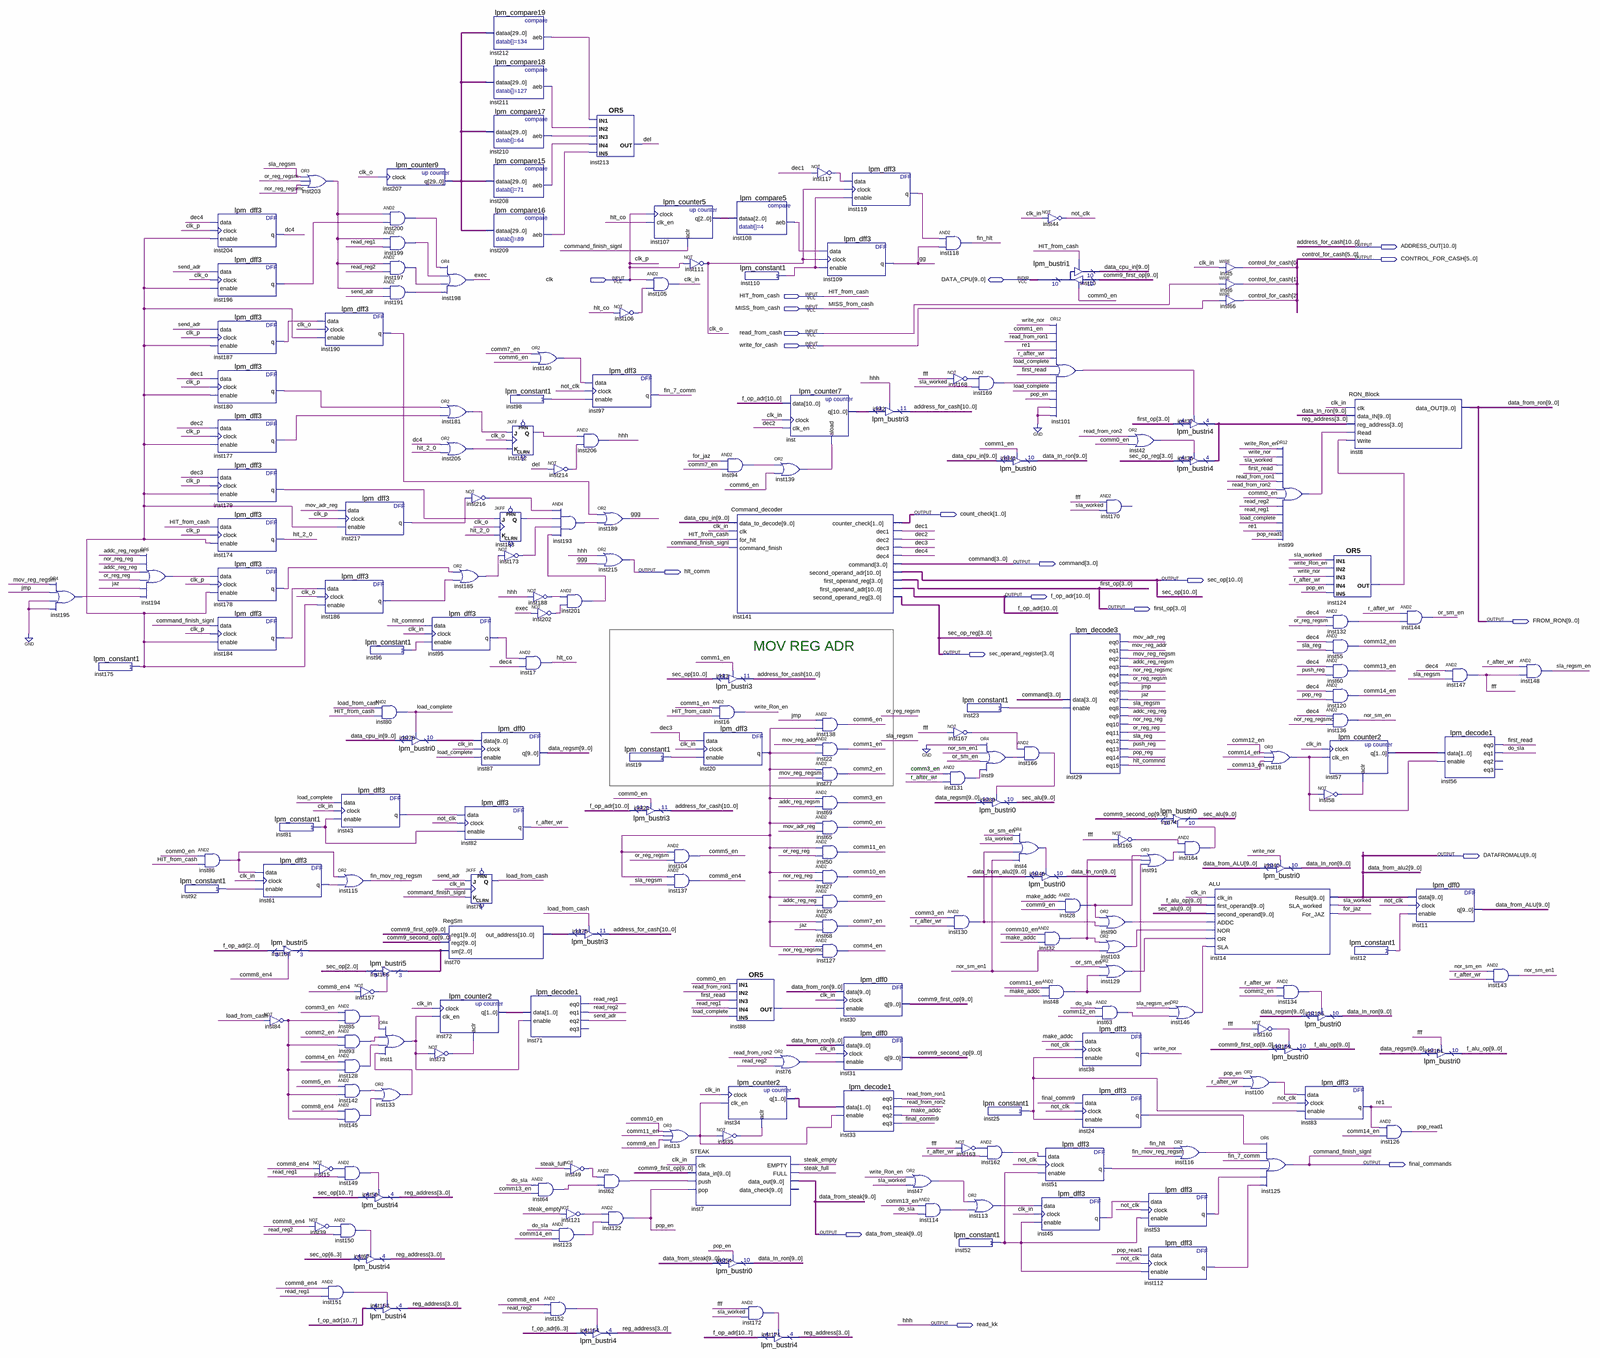
[diagram p0: schematic sheet, whole]
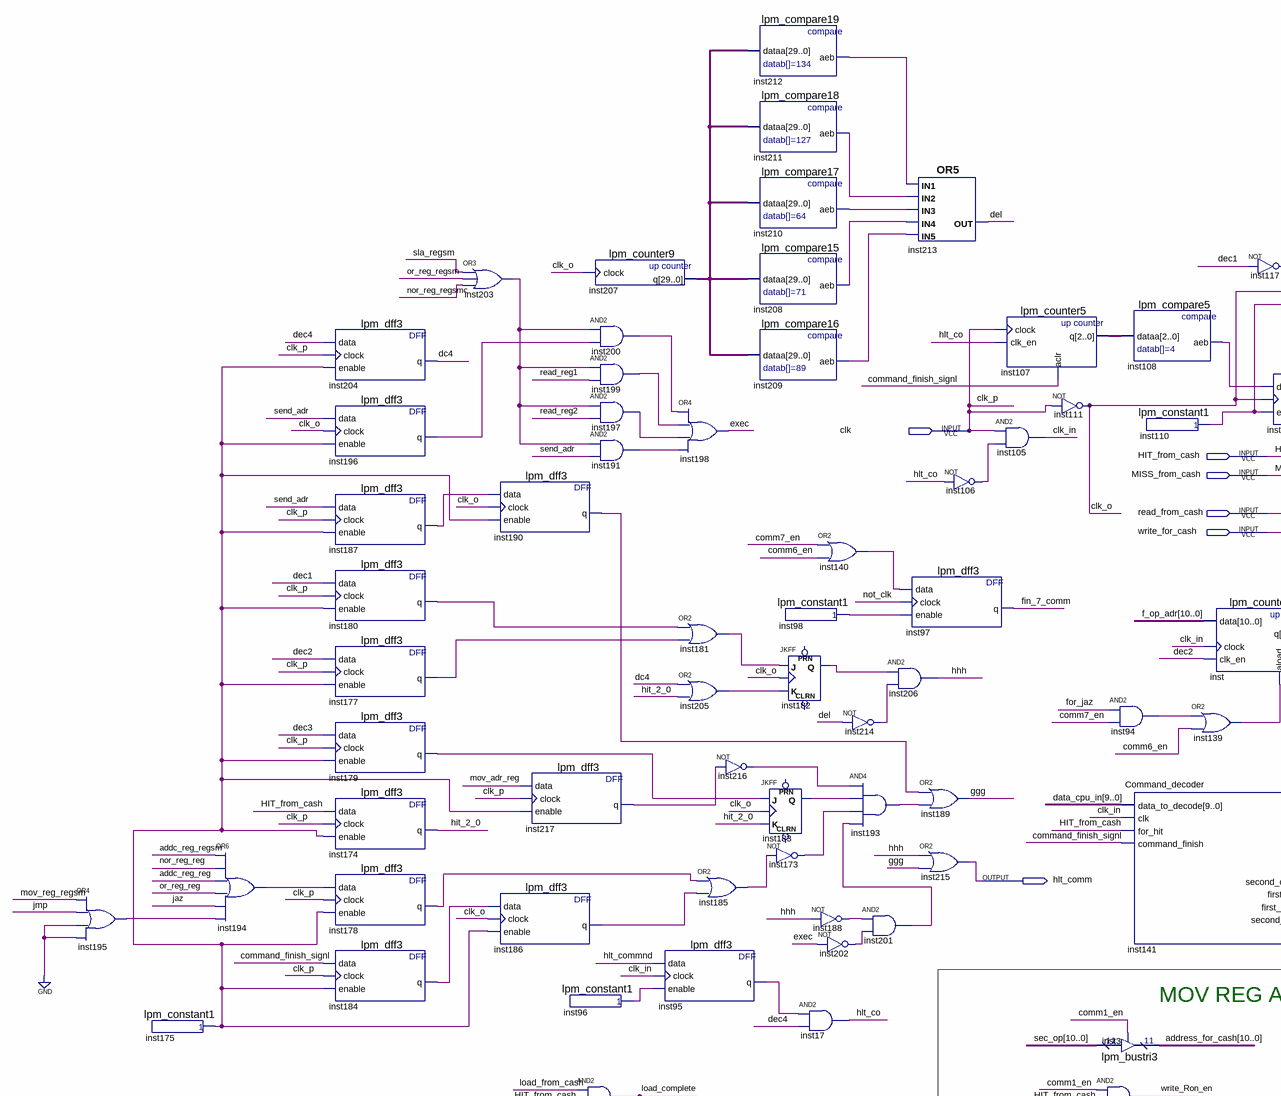
[diagram p1: schematic sheet, upper left part]
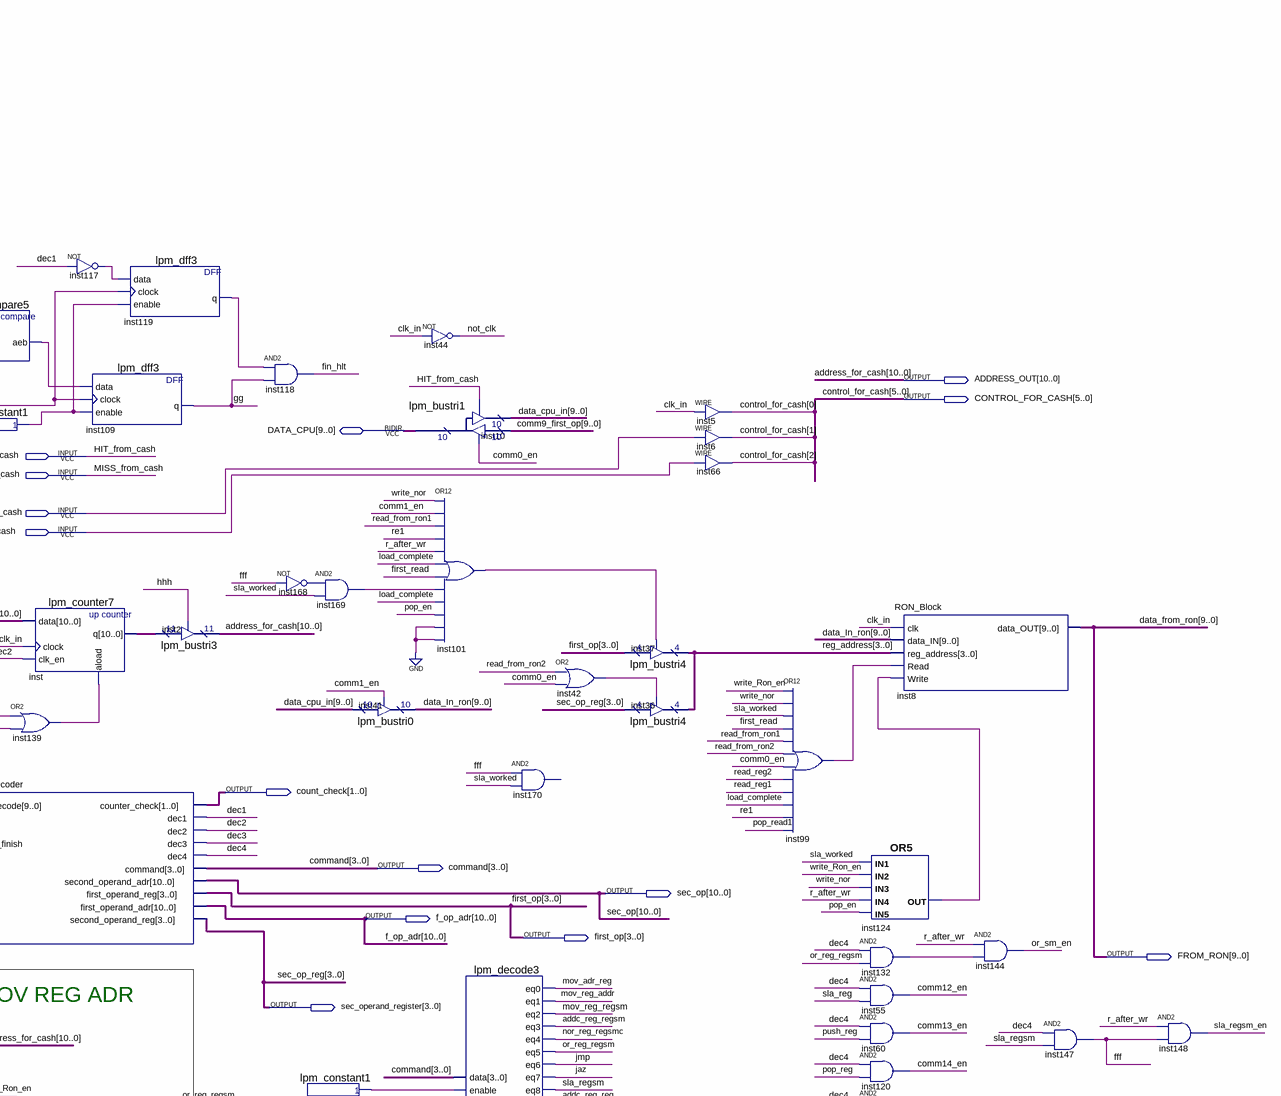
[diagram p2: schematic sheet, upper right part]
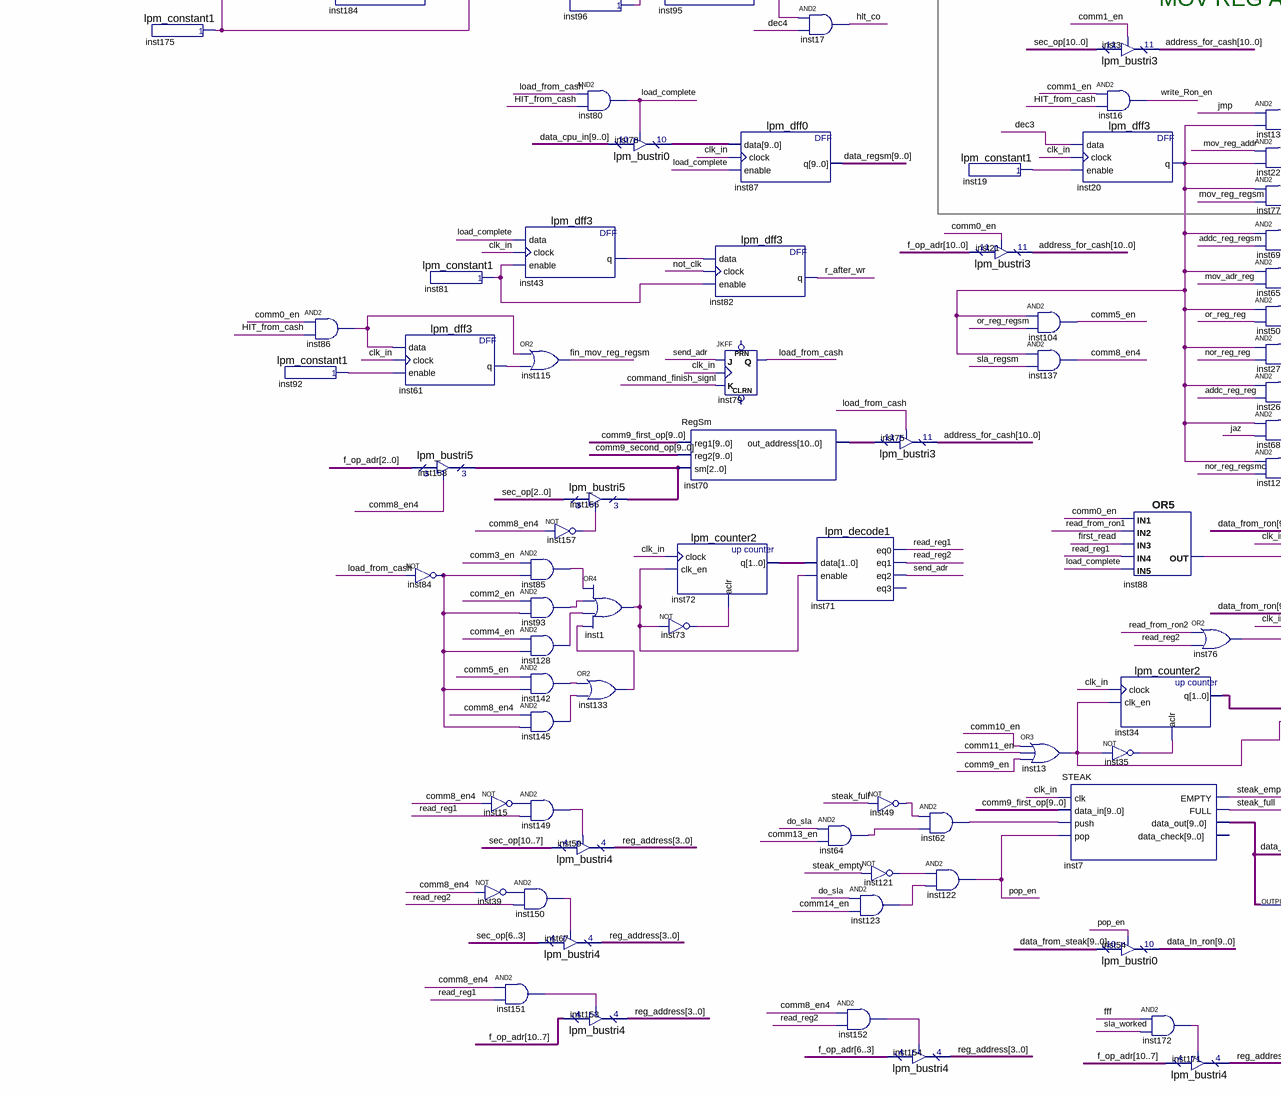
[diagram p3: schematic sheet, lower left part]
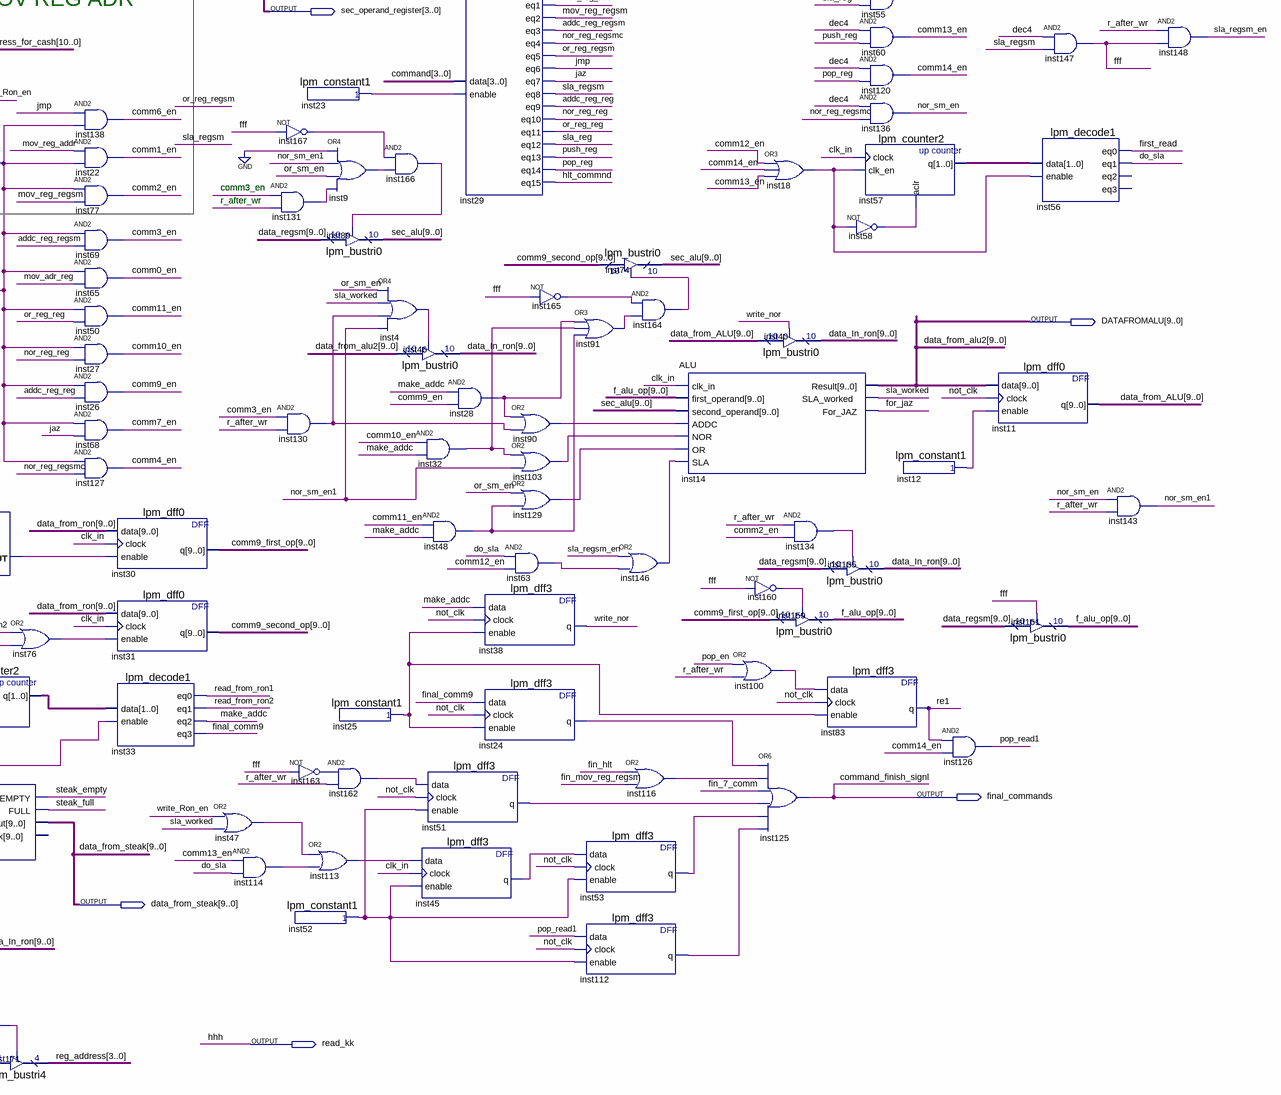
[diagram p4: schematic sheet, lower right part]
// Quartus schematic CPU.bdf as structural Verilog: 214 symbols, 20 pins
module CPU (
  input  clk,
  input  HIT_from_cash,
  input  MISS_from_cash,
  input  read_from_cash,
  input  write_for_cash,
  inout  [9:0] DATA_CPU,
  output [10:0] ADDRESS_OUT,
  output [5:0] CONTROL_FOR_CASH,
  output [1:0] count_check,
  output [3:0] command,
  output hlt_comm,
  output [10:0] sec_op,
  output [10:0] f_op_adr,
  output [3:0] first_op,
  output [9:0] FROM_RON,
  output [3:0] sec_operand_register,
  output [9:0] DATAFROMALU,
  output final_commands,
  output [9:0] data_from_steak,
  output read_kk
);

  wire addc_reg_reg, addc_reg_regsm, clk_in, clk_o, comm0_en, comm1_en, comm2_en, comm3_en, comm4_en,
       comm5_en, comm6_en, comm7_en, comm8_en4, comm9_en, comm10_en, comm11_en, comm12_en, comm13_en,
       comm14_en, dc4, dec1, dec2, dec3, dec4, del, do_sla, exec, fff, fin_7_comm, fin_hlt,
       fin_mov_reg_regsm, final_comm9, first_read, for_jaz, gg, ggg, hit_2_0, hlt_co, hlt_commnd, inst1_out,
       inst4_out, inst9_out, inst12_result, inst13_out, inst15_out, inst18_out, inst19_result, inst20_q,
       inst23_result, inst24_q, inst25_result, inst28_out, inst32_out, inst35_out, inst39_out, inst42_out,
       inst43_q, inst45_q, inst47_out, inst48_out, inst49_out, inst51_q, inst52_result, inst53_q, inst58_out,
       inst61_q, inst62_out, inst63_out, inst64_out, inst73_out, inst76_out, inst81_result, inst84_out,
       inst85_out, inst86_out, inst88_out, inst90_out, inst91_out, inst92_result, inst93_out, inst94_out,
       inst95_q, inst96_result, inst98_result, inst99_out, inst100_out, inst101_out, inst103_out,
       inst106_out, inst108_aeb, inst110_result, inst112_q, inst113_out, inst114_out, inst116_out,
       inst117_out, inst119_q, inst121_out, inst123_out, inst124_out, inst128_out, inst129_out, inst130_out,
       inst131_out, inst132_out, inst133_out, inst134_out, inst139_out, inst140_out, inst142_out,
       inst145_out, inst146_out, inst149_out, inst150_out, inst151_out, inst152_out, inst157_out,
       inst160_out, inst162_out, inst163_out, inst164_out, inst165_out, inst166_out, inst167_out,
       inst168_out, inst169_out, inst172_out, inst173_out, inst175_result, inst177_q, inst178_q, inst179_q,
       inst180_q, inst181_out, inst182_q, inst183_q, inst184_q, inst185_out, inst186_q, inst187_q,
       inst188_out, inst190_q, inst191_out, inst193_out, inst194_out, inst195_out, inst196_q, inst197_out,
       inst199_out, inst200_out, inst201_out, inst202_out, inst203_out, inst205_out, inst208_aeb,
       inst209_aeb, inst210_aeb, inst211_aeb, inst212_aeb, inst214_out, inst216_out, inst217_q, jaz, jmp,
       load_complete, load_from_cash, make_addc, mov_adr_reg, mov_reg_addr, mov_reg_regsm, nor_reg_reg,
       nor_reg_regsmc, nor_sm_en, nor_sm_en1, not_clk, or_reg_reg, or_reg_regsm, or_sm_en, pop_en, pop_read1,
       pop_reg, push_reg, r_after_wr, re1, read_from_ron1, read_from_ron2, read_reg1, read_reg2, send_adr,
       sla_reg, sla_regsm, sla_regsm_en, sla_worked, steak_empty, steak_full, write_nor, write_Ron_en;
  wire [1:0] inst34_q, inst57_q, inst72_q;
  wire [2:0] inst107_q, inst158_tridata;
  wire [3:0] reg_address;
  wire [9:0] comm9_first_op, comm9_second_op, data_cpu_in, data_from_ALU, data_In_ron, data_regsm, f_alu_op,
       inst78_tridata, sec_alu;
  wire [10:0] inst70_out_address, inst_q;
  wire [29:0] inst207_q;

  or inst195 (inst195_out, mov_reg_regsm, jmp, 1'b0, 1'b0);
  lpm_constant1 inst175 (.result(inst175_result));
  or inst194 (inst194_out, addc_reg_regsm, nor_reg_reg, addc_reg_reg, or_reg_reg, jaz, inst195_out);
  lpm_constant1 inst92 (.result(inst92_result));
  lpm_dff3 inst204 (.data(dec4), .clock(clk), .enable(inst175_result), .q(dc4));
  lpm_dff3 inst196 (.data(send_adr), .clock(clk_o), .enable(inst175_result), .q(inst196_q));
  lpm_dff3 inst187 (.data(send_adr), .clock(clk), .enable(inst175_result), .q(inst187_q));
  lpm_dff3 inst180 (.data(dec1), .clock(clk), .enable(inst175_result), .q(inst180_q));
  lpm_dff3 inst177 (.data(dec2), .clock(clk), .enable(inst175_result), .q(inst177_q));
  lpm_dff3 inst179 (.data(dec3), .clock(clk), .enable(inst175_result), .q(inst179_q));
  lpm_dff3 inst174 (.data(HIT_from_cash), .clock(clk), .enable(inst175_result), .q(hit_2_0));
  lpm_dff3 inst178 (.data(inst194_out), .clock(clk), .enable(inst175_result), .q(inst178_q));
  lpm_dff3 inst184 (.data(final_commands), .clock(clk), .enable(inst175_result), .q(inst184_q));
  and inst86 (inst86_out, comm0_en, HIT_from_cash);
  lpm_constant1 inst81 (.result(inst81_result));
  lpm_dff3 inst61 (.data(inst86_out), .clock(clk_in), .enable(inst92_result), .q(inst61_q));
  lpm_bustri5 inst158 (.enabledt(comm8_en4), .data(f_op_adr[2:0]), .tridata(inst158_tridata));
  not inst84 (inst84_out, load_from_cash);
  or inst203 (inst203_out, sla_regsm, or_reg_regsm, nor_reg_regsmc);
  not inst39 (inst39_out, comm8_en4);
  lpm_dff3 inst190 (.data(inst187_q), .clock(clk_o), .enable(inst175_result), .q(inst190_q));
  lpm_dff3 inst217 (.data(mov_adr_reg), .clock(clk), .enable(inst175_result), .q(inst217_q));
  lpm_dff3 inst186 (.data(inst184_q), .clock(clk_o), .enable(inst175_result), .q(inst186_q));
  lpm_dff3 inst43 (.data(load_complete), .clock(clk_in), .enable(inst81_result), .q(inst43_q));
  or inst115 (fin_mov_reg_regsm, inst86_out, inst61_q);
  and inst85 (inst85_out, comm3_en, inst84_out);
  and inst93 (inst93_out, comm2_en, inst84_out);
  and inst128 (inst128_out, comm4_en, inst84_out);
  and inst142 (inst142_out, comm5_en, inst84_out);
  and inst145 (inst145_out, comm8_en4, inst84_out);
  and inst149 (inst149_out, inst15_out, read_reg1);
  not inst15 (inst15_out, comm8_en4);
  and inst150 (inst150_out, inst39_out, read_reg2);
  and inst151 (inst151_out, comm8_en4, read_reg1);
  lpm_constant1 inst96 (.result(inst96_result));
  and inst80 (load_complete, load_from_cash, HIT_from_cash);
  lpm_bustri5 inst156 (.enabledt(inst157_out), .data(sec_op[2:0]), .tridata(inst158_tridata));
  not inst157 (inst157_out, comm8_en4);
  or inst133 (inst133_out, inst142_out, inst145_out);
  lpm_bustri4 inst59 (.enabledt(inst149_out), .data(sec_op[10:7]), .tridata(reg_address));
  lpm_bustri4 inst67 (.enabledt(inst150_out), .data(sec_op[6:3]), .tridata(reg_address));
  lpm_bustri4 inst153 (.enabledt(inst151_out), .data(f_op_adr[10:7]), .tridata(reg_address));
  lpm_counter9 inst207 (.clock(clk_o), .q(inst207_q));
  and inst200 (inst200_out, inst203_out, inst196_q);
  and inst199 (inst199_out, inst203_out, read_reg1);
  and inst197 (inst197_out, inst203_out, read_reg2);
  and inst191 (inst191_out, inst203_out, send_adr);
  lpm_bustri0 inst78 (.enabledt(load_complete), .data(data_cpu_in), .tridata(inst78_tridata));
  or inst1 (inst1_out, inst85_out, inst93_out, inst128_out, inst133_out);
  or inst198 (exec, inst200_out, inst199_out, inst197_out, inst191_out);
  or inst181 (inst181_out, inst180_q, inst177_q);
  or inst205 (inst205_out, dc4, hit_2_0);
  lpm_dff3 inst95 (.data(hlt_commnd), .clock(clk_in), .enable(inst96_result), .q(inst95_q));
  RegSm inst70 (.reg1(comm9_first_op), .reg2(comm9_second_op), .sm(inst158_tridata), .out_address(inst70_out_address));
  lpm_counter2 inst72 (.clock(clk_in), .clk_en(inst1_out), .aclr(inst73_out), .q(inst72_q));
  not inst73 (inst73_out, inst1_out);
  not inst216 (inst216_out, inst217_q);
  or inst185 (inst185_out, inst178_q, inst186_q);
  lpm_dff0 inst87 (.data(inst78_tridata), .clock(clk_in), .enable(load_complete), .q(data_regsm));
  lpm_dff3 inst82 (.data(inst43_q), .clock(not_clk), .enable(inst81_result), .q(r_after_wr));
  JKFF inst79 (.K(final_commands), .J(send_adr), .CLK(clk_in), .Q(load_from_cash));  // open: PRN, CLRN
  lpm_compare19 inst212 (.dataa(inst207_q), .aeb(inst212_aeb));
  lpm_compare18 inst211 (.dataa(inst207_q), .aeb(inst211_aeb));
  lpm_compare17 inst210 (.dataa(inst207_q), .aeb(inst210_aeb));
  lpm_compare15 inst208 (.dataa(inst207_q), .aeb(inst208_aeb));
  lpm_compare16 inst209 (.dataa(inst207_q), .aeb(inst209_aeb));
  lpm_constant1 inst98 (.result(inst98_result));
  JKFF inst182 (.K(inst205_out), .J(inst181_out), .CLK(clk_o), .Q(inst182_q));  // open: PRN, CLRN
  JKFF inst183 (.K(hit_2_0), .J(inst179_q), .CLK(clk_o), .Q(inst183_q));  // open: PRN, CLRN
  not inst173 (inst173_out, inst185_out);
  or inst140 (inst140_out, comm7_en, comm6_en);
  not inst188 (inst188_out, read_kk);
  not inst202 (inst202_out, exec);
  and inst17 (hlt_co, inst95_q, dec4);
  lpm_decode1 inst71 (
    .data(inst72_q), .enable(inst1_out), .eq0(read_reg1), .eq1(read_reg2), .eq2(send_adr));  // open: eq3
  and inst64 (inst64_out, do_sla, comm13_en);
  not inst214 (inst214_out, del);
  and inst193 (inst193_out, inst216_out, inst183_q, inst173_out, inst201_out);
  and inst201 (inst201_out, inst188_out, inst202_out);
  lpm_bustri3 inst75 (.enabledt(load_from_cash), .data(inst70_out_address), .tridata(ADDRESS_OUT));
  not inst49 (inst49_out, steak_full);
  not inst121 (inst121_out, steak_empty);
  and inst123 (inst123_out, do_sla, comm14_en);
  and inst152 (inst152_out, comm8_en4, read_reg2);
  or inst213 (del, inst212_aeb, inst211_aeb, inst210_aeb, inst208_aeb, inst209_aeb);
  lpm_dff3 inst97 (.data(inst140_out), .clock(not_clk), .enable(inst98_result), .q(fin_7_comm));
  and inst206 (read_kk, inst182_q, inst214_out);
  or inst189 (ggg, inst190_q, inst193_out);
  or inst215 (hlt_comm, read_kk, ggg);
  and inst62 (inst62_out, inst49_out, inst64_out);
  and inst122 (pop_en, inst121_out, inst123_out);
  lpm_bustri4 inst154 (.enabledt(inst152_out), .data(f_op_adr[6:3]), .tridata(reg_address));
  not inst106 (inst106_out, hlt_co);
  lpm_constant1 inst19 (.result(inst19_result));
  lpm_bustri3 inst21 (.enabledt(comm0_en), .data(f_op_adr), .tridata(ADDRESS_OUT));
  lpm_counter5 inst107 (.clock(clk), .clk_en(hlt_co), .aclr(final_commands), .q(inst107_q));
  and inst105 (clk_in, clk, inst106_out);
  and inst104 (comm5_en, inst20_q, or_reg_regsm);
  and inst137 (comm8_en4, inst20_q, sla_regsm);
  or inst13 (inst13_out, comm10_en, comm11_en, comm9_en);
  not inst111 (clk_o, clk);
  lpm_dff3 inst20 (.data(dec3), .clock(clk_in), .enable(inst19_result), .q(inst20_q));
  STEAK inst7 (
    .clk(clk_in), .data_in(comm9_first_op), .push(inst62_out), .pop(pop_en), .EMPTY(steak_empty),
    .FULL(steak_full), .data_out(data_from_steak));  // open: data_check
  lpm_compare5 inst108 (.dataa(inst107_q), .aeb(inst108_aeb));
  lpm_constant1 inst110 (.result(inst110_result));
  and inst94 (inst94_out, for_jaz, comm7_en);
  Command_decoder inst141 (
    .data_to_decode(data_cpu_in), .clk(clk_in), .for_hit(HIT_from_cash), .command_finish(final_commands),
    .counter_check(count_check), .dec1(dec1), .dec2(dec2), .dec3(dec3), .dec4(dec4), .command(command),
    .second_operand_adr(sec_op), .first_operand_reg(first_op), .first_operand_adr(f_op_adr),
    .second_operand_reg(sec_operand_register));
  lpm_bustri3 inst3 (.enabledt(comm1_en), .data(sec_op), .tridata(ADDRESS_OUT));
  and inst16 (write_Ron_en, comm1_en, HIT_from_cash);
  or inst88 (inst88_out, comm0_en, read_from_ron1, first_read, read_reg1, load_complete);
  lpm_counter2 inst34 (.clock(clk_in), .clk_en(inst13_out), .aclr(inst35_out), .q(inst34_q));
  not inst35 (inst35_out, inst13_out);
  lpm_bustri0 inst54 (.enabledt(pop_en), .data(data_from_steak), .tridata(data_In_ron));
  and inst172 (inst172_out, fff, sla_worked);
  lpm_bustri4 inst171 (.enabledt(inst172_out), .data(f_op_adr[10:7]), .tridata(reg_address));
  lpm_counter7 inst (.data(f_op_adr), .clock(clk_in), .clk_en(dec2), .aload(inst139_out), .q(inst_q));
  or inst139 (inst139_out, inst94_out, comm6_en);
  or inst76 (inst76_out, read_from_ron2, read_reg2);
  not inst117 (inst117_out, dec1);
  lpm_dff3 inst109 (.data(inst108_aeb), .clock(clk_o), .enable(inst110_result), .q(gg));
  and inst138 (comm6_en, jmp, inst20_q);
  and inst22 (comm1_en, mov_reg_addr, inst20_q);
  and inst77 (comm2_en, inst20_q, mov_reg_regsm);
  and inst69 (comm3_en, inst20_q, addc_reg_regsm);
  and inst65 (comm0_en, inst20_q, mov_adr_reg);
  and inst50 (comm11_en, inst20_q, or_reg_reg);
  and inst27 (comm10_en, inst20_q, nor_reg_reg);
  and inst26 (comm9_en, inst20_q, addc_reg_reg);
  and inst68 (comm7_en, inst20_q, jaz);
  and inst127 (comm4_en, inst20_q, nor_reg_regsmc);
  lpm_dff0 inst30 (.data(FROM_RON), .clock(clk_in), .enable(inst88_out), .q(comm9_first_op));
  lpm_dff0 inst31 (.data(FROM_RON), .clock(clk_in), .enable(inst76_out), .q(comm9_second_op));
  lpm_decode1 inst33 (
    .data(inst34_q), .enable(inst13_out), .eq0(read_from_ron1), .eq1(read_from_ron2), .eq2(make_addc),
    .eq3(final_comm9));
  lpm_dff3 inst119 (.data(inst117_out), .clock(clk_o), .enable(inst110_result), .q(inst119_q));
  lpm_bustri3 inst2 (.enabledt(read_kk), .data(inst_q), .tridata(ADDRESS_OUT));
  or inst47 (inst47_out, write_Ron_en, sla_worked);
  and inst114 (inst114_out, comm13_en, do_sla);
  and inst118 (fin_hlt, inst119_q, gg);
  not inst168 (inst168_out, fff);
  lpm_constant1 inst23 (.result(inst23_result));
  not inst167 (inst167_out, fff);
  and inst131 (inst131_out, comm3_en, r_after_wr);
  and inst130 (inst130_out, comm3_en, r_after_wr);
  not inst163 (inst163_out, fff);
  or inst113 (inst113_out, inst47_out, inst114_out);
  lpm_constant1 inst52 (.result(inst52_result));
  and inst169 (inst169_out, inst168_out, sla_worked);
  lpm_bustri0 inst41 (.enabledt(comm1_en), .data(data_cpu_in), .tridata(data_In_ron));
  or inst9 (inst9_out, 1'b0, nor_sm_en1, or_sm_en, inst131_out);
  lpm_bustri0 inst89 (.enabledt(inst166_out), .data(data_regsm), .tridata(sec_alu));
  lpm_constant1 inst25 (.result(inst25_result));
  and inst162 (inst162_out, inst163_out, r_after_wr);
  and inst166 (inst166_out, inst167_out, inst9_out);
  or inst4 (inst4_out, or_sm_en, sla_worked, inst130_out, nor_sm_en1);
  lpm_bustri0 inst46 (.enabledt(inst4_out), .data(DATAFROMALU), .tridata(data_In_ron));
  lpm_dff3 inst45 (.data(inst113_out), .clock(clk_in), .enable(inst52_result), .q(inst45_q));
  not inst44 (not_clk, clk_in);
  lpm_bustri1 inst10 (
    .enabledt(comm0_en), .data(comm9_first_op), .enabletr(HIT_from_cash), .result(data_cpu_in),
    .tridata(DATA_CPU));
  or inst101 (inst101_out, write_nor, comm1_en, read_from_ron1, re1, r_after_wr, load_complete, first_read, inst169_out, load_complete, pop_en, 1'b0, 1'b0);
  lpm_decode3 inst29 (
    .data(command), .enable(inst23_result), .eq0(mov_adr_reg), .eq1(mov_reg_addr), .eq2(mov_reg_regsm),
    .eq3(addc_reg_regsm), .eq4(nor_reg_regsmc), .eq5(or_reg_regsm), .eq6(jmp), .eq7(jaz), .eq8(sla_regsm),
    .eq9(addc_reg_reg), .eq10(nor_reg_reg), .eq11(or_reg_reg), .eq12(sla_reg), .eq13(push_reg),
    .eq14(pop_reg), .eq15(hlt_commnd));
  and inst28 (inst28_out, make_addc, comm9_en);
  and inst32 (inst32_out, comm10_en, make_addc);
  and inst48 (inst48_out, comm11_en, make_addc);
  lpm_dff3 inst51 (.data(inst162_out), .clock(not_clk), .enable(inst52_result), .q(inst51_q));
  // AND2 inst170 has open pins: IN1=fff, IN2=sla_worked, OUT=open
  or inst90 (inst90_out, inst28_out, inst130_out);
  or inst103 (inst103_out, inst32_out, nor_sm_en1);
  or inst129 (inst129_out, or_sm_en, inst48_out);
  and inst63 (inst63_out, do_sla, comm12_en);
  lpm_dff3 inst38 (.data(make_addc), .clock(not_clk), .enable(inst25_result), .q(write_nor));
  lpm_dff3 inst24 (.data(final_comm9), .clock(not_clk), .enable(inst25_result), .q(inst24_q));
  or inst42 (inst42_out, read_from_ron2, comm0_en);
  not inst165 (inst165_out, fff);
  lpm_bustri0 inst74 (.enabledt(inst164_out), .data(comm9_second_op), .tridata(sec_alu));
  or inst91 (inst91_out, inst28_out, inst32_out, inst48_out);
  lpm_dff3 inst53 (.data(inst45_q), .clock(not_clk), .enable(inst52_result), .q(inst53_q));
  lpm_dff3 inst112 (.data(pop_read1), .clock(not_clk), .enable(inst52_result), .q(inst112_q));
  lpm_bustri4 inst37 (.enabledt(inst101_out), .data(first_op), .tridata(reg_address));
  lpm_bustri4 inst36 (.enabledt(inst42_out), .data(sec_operand_register), .tridata(reg_address));
  and inst164 (inst164_out, inst165_out, inst91_out);
  or inst146 (inst146_out, sla_regsm_en, inst63_out);
  or inst116 (inst116_out, fin_hlt, fin_mov_reg_regsm);
  assign CONTROL_FOR_CASH[0] = clk_in;  // WIRE inst5
  assign CONTROL_FOR_CASH[1] = read_from_cash;  // WIRE inst6
  assign CONTROL_FOR_CASH[2] = write_for_cash;  // WIRE inst66
  ALU inst14 (
    .clk_in(clk_in), .first_operand(f_alu_op), .second_operand(sec_alu), .ADDC(inst90_out),
    .NOR(inst103_out), .OR(inst129_out), .SLA(inst146_out), .Result(DATAFROMALU), .SLA_worked(sla_worked),
    .For_JAZ(for_jaz));
  or inst18 (inst18_out, comm12_en, comm14_en, comm13_en);
  lpm_bustri0 inst40 (.enabledt(write_nor), .data(data_from_ALU), .tridata(data_In_ron));
  not inst160 (inst160_out, fff);
  or inst100 (inst100_out, pop_en, r_after_wr);
  or inst125 (final_commands, inst24_q, inst116_out, fin_7_comm, inst51_q, inst53_q, inst112_q);
  or inst99 (inst99_out, write_Ron_en, write_nor, sla_worked, first_read, read_from_ron1, read_from_ron2, comm0_en, read_reg2, read_reg1, load_complete, re1, pop_read1);
  and inst134 (inst134_out, r_after_wr, comm2_en);
  lpm_bustri0 inst159 (.enabledt(inst160_out), .data(comm9_first_op), .tridata(f_alu_op));
  lpm_dff3 inst83 (.data(inst100_out), .clock(not_clk), .enable(inst25_result), .q(re1));
  or inst124 (inst124_out, sla_worked, write_Ron_en, write_nor, r_after_wr, pop_en);
  and inst132 (inst132_out, dec4, or_reg_regsm);
  and inst55 (comm12_en, dec4, sla_reg);
  and inst60 (comm13_en, dec4, push_reg);
  and inst120 (comm14_en, dec4, pop_reg);
  and inst136 (nor_sm_en, dec4, nor_reg_regsmc);
  lpm_counter2 inst57 (.clock(clk_in), .clk_en(inst18_out), .aclr(inst58_out), .q(inst57_q));
  not inst58 (inst58_out, inst18_out);
  lpm_bustri0 inst135 (.enabledt(inst134_out), .data(data_regsm), .tridata(data_In_ron));
  RON_Block inst8 (
    .clk(clk_in), .data_IN(data_In_ron), .reg_address(reg_address), .Read(inst99_out), .Write(inst124_out),
    .data_OUT(FROM_RON));
  lpm_constant1 inst12 (.result(inst12_result));
  and inst126 (pop_read1, re1, comm14_en);
  and inst144 (or_sm_en, r_after_wr, inst132_out);
  lpm_dff0 inst11 (.data(DATAFROMALU), .clock(not_clk), .enable(inst12_result), .q(data_from_ALU));
  lpm_bustri0 inst161 (.enabledt(fff), .data(data_regsm), .tridata(f_alu_op));
  and inst147 (fff, dec4, sla_regsm);
  lpm_decode1 inst56 (.data(inst57_q), .enable(inst18_out), .eq0(first_read), .eq1(do_sla));  // open: eq2, eq3
  and inst143 (nor_sm_en1, nor_sm_en, r_after_wr);
  and inst148 (sla_regsm_en, r_after_wr, fff);

  // Other names for the same wires on the sheet: address_for_cash[10:0] = ADDRESS_OUT; clk_p = clk;
  //   command_finish_signl = final_commands; data_from_alu2[9:0] = DATAFROMALU; data_from_ron[9:0] = FROM_RON;
  //   hhh = read_kk; sec_op_reg[3:0] = sec_operand_register

  // Notes on the sheet:
  //   MOV REG ADR
  //   comm3_en
  //   r_after_wr
endmodule
